# EAGLE design March (EAGLE 9.0.1)
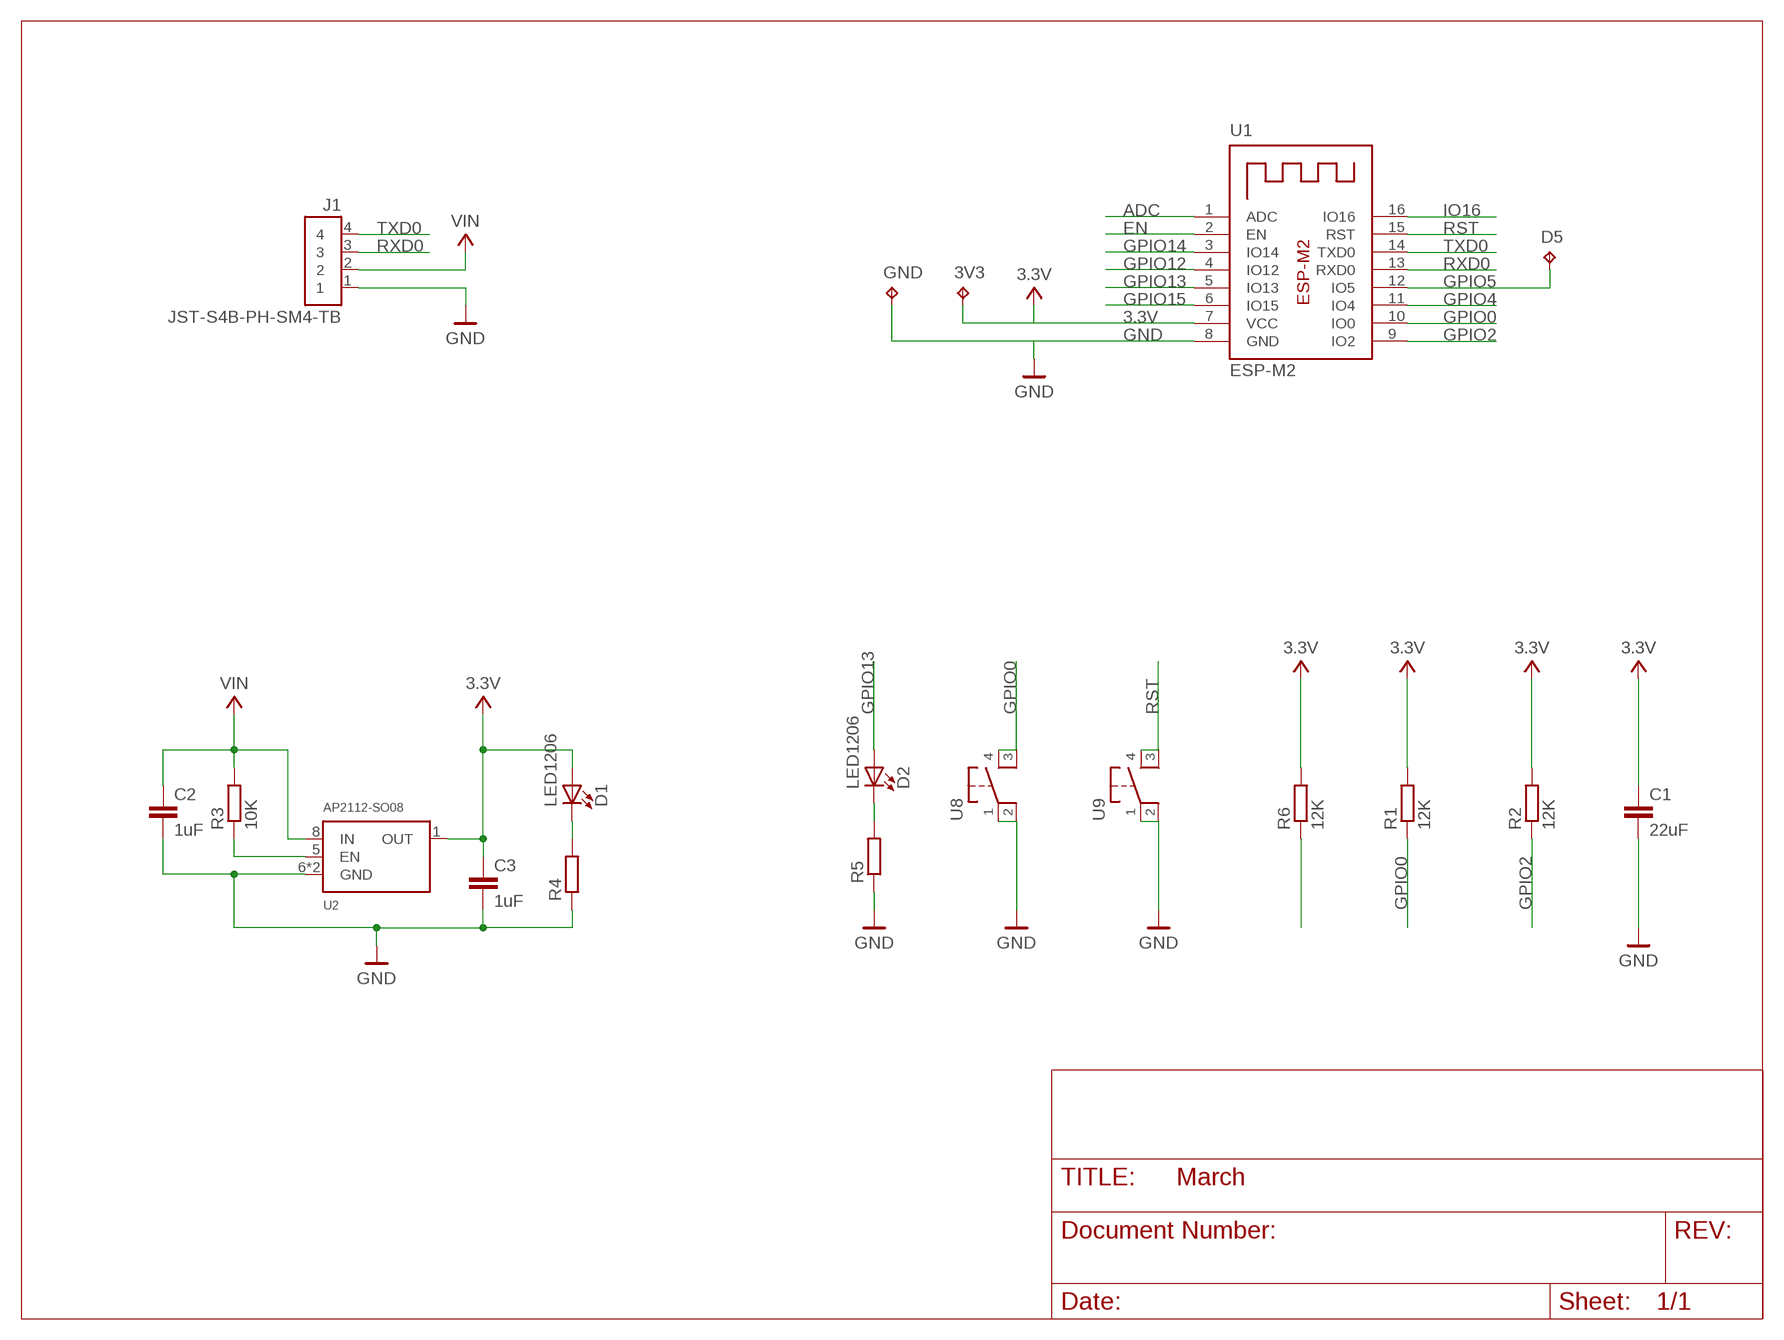
[diagram p0: schematic, sheet 1]

## Parts
3V3  TPTP16R  [TP16R]
C1  22uF  C-EUC1206  [C1206]
C2  1uF  C-EUC1206  [C1206]
C3  1uF  C-EUC1206  [C1206]
D1  LED1206  [LED1206]
D2  LED1206  [LED1206]
D5  TPTP16R  [TP16R]
GND  TPTP16R  [TP16R]
J1  JST-S4B-PH-SM4-TB  [JST-S4B-PH-SM4-TB]
R1  12K  R-EU_R1206  [R1206]
R2  12K  R-EU_R1206  [R1206]
R3  10K  R-EU_R1206  [R1206]
R4  R-EU_R1206  [R1206]
R5  R-EU_R1206  [R1206]
R6  12K  R-EU_R1206  [R1206]
U1  ESP-M2  [ESP-M2]
U2  AP2112-SO08  [SO08]
U8  PTS647  [PTS647]
U9  PTS647  [PTS647]

## Nets
3.3V: 3V3.TP C1.1 C3.1 D1.2(A) R1.2 R2.2 R6.2 U1.7(VCC) U2.1(OUT)
ADC: U1.1(ADC)
EN: R6.1 U1.2(EN)
GND: C1.2 C2.2 C3.2 GND.TP J1.1 R4.1 R5.1 U1.8(GND) U2.6(GND) U2.7(GND) U8.1 U8.2 U9.1 U9.2
GPIO0: R1.1 U1.10(IO0) U8.3 U8.4
GPIO2: R2.1 U1.9(IO2)
GPIO4: U1.11(IO4)
GPIO5: D5.TP U1.12(IO5)
GPIO12: U1.4(IO12)
GPIO13: D2.2(A) U1.5(IO13)
GPIO14: U1.3(IO14)
GPIO15: U1.6(IO15)
IO16: U1.16(IO16)
N$1: D1.1(C) R4.2
N$2: R3.1 U2.5(EN)
N$4: D2.1(C) R5.2
RST: U1.15(RST) U9.3 U9.4
RXD0: J1.3 U1.13(RXD0)
TXD0: J1.4 U1.14(TXD0)
VIN: C2.1 J1.2 R3.2 U2.8(IN)

## Library data of the parts
3V3 D5 GND = testpad:TP: Test pad
C1-C3 = rcl:C-EU: CAPACITOR, European symbol; SPICEPREFIX: C
D1 D2 = Ooo-LED:LED1206
J1 = Ooo-Connectors:JST-S4B-PH-SM4-TB
R1-R3 R6 = rcl:R-EU_: RESISTOR, European symbol; SPICEPREFIX: R
R4 R5 = resistor:R-EU_: RESISTOR, European symbol
U1 = Ooo-IC-Microcontroller:ESP-M2
U2 = Ooo-IC-Power:AP2112-SO08
U8 U9 = Ooo-Switches:PTS647: C&K PTS647 Tact Switch

## Board
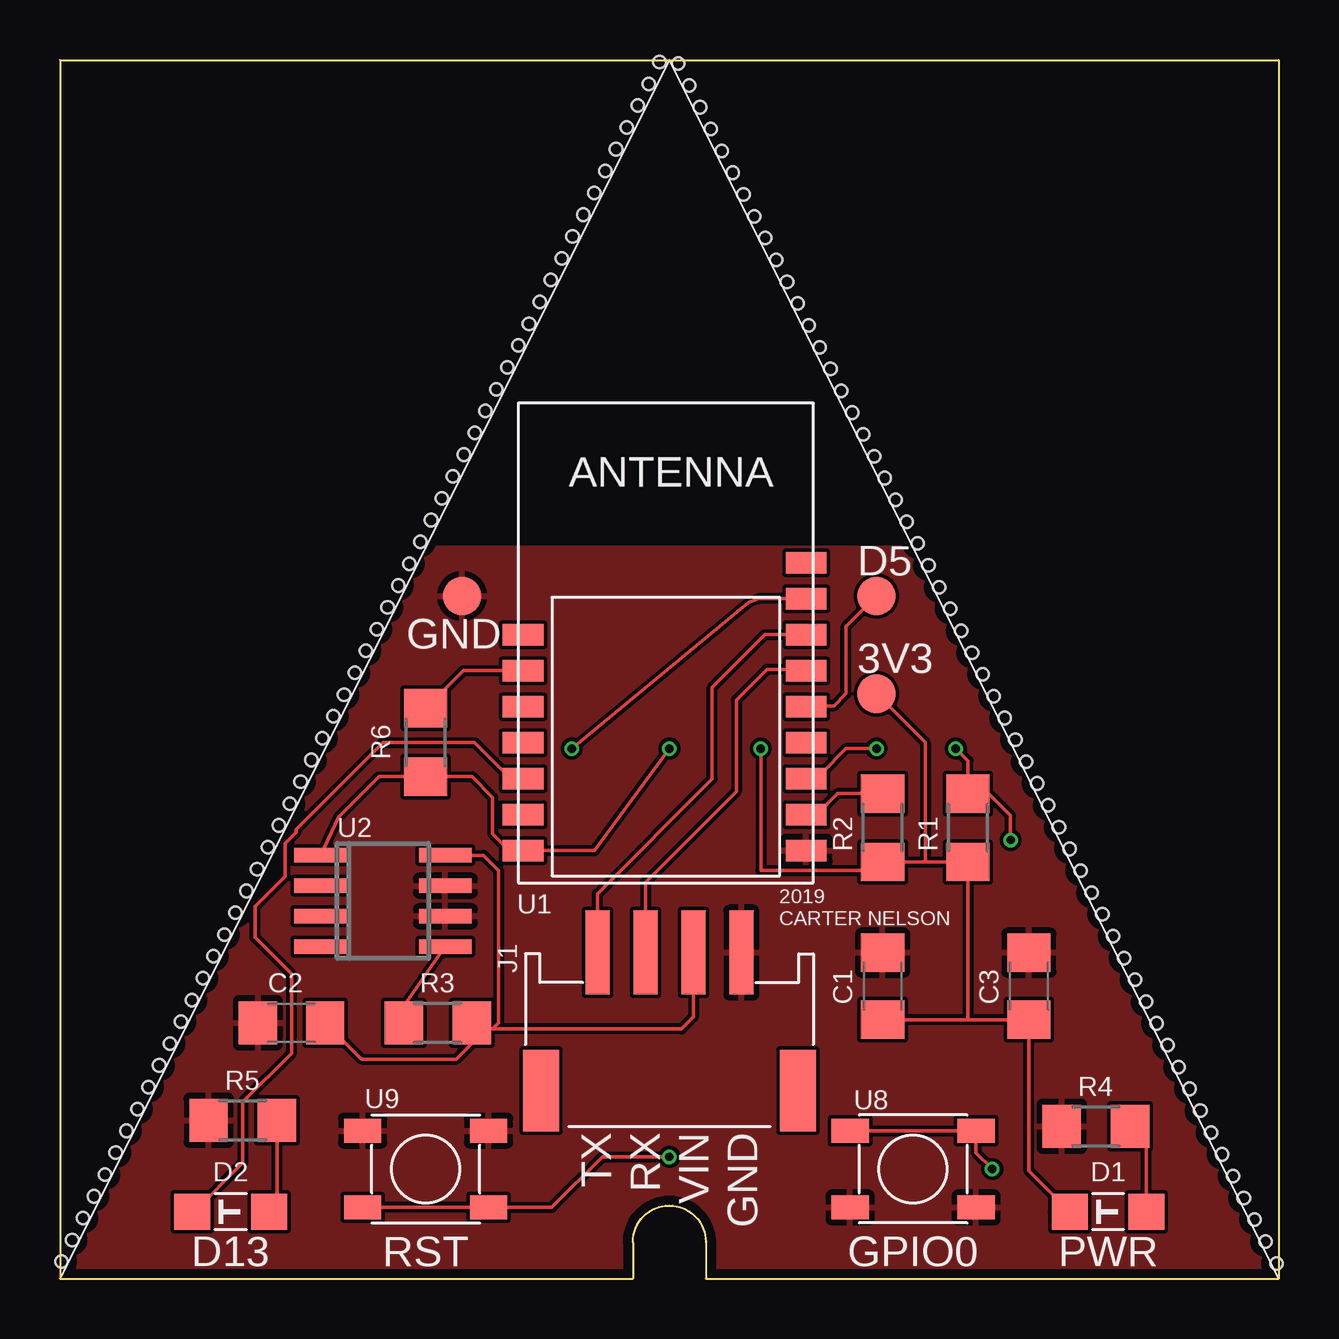
[diagram p1: board, top side]
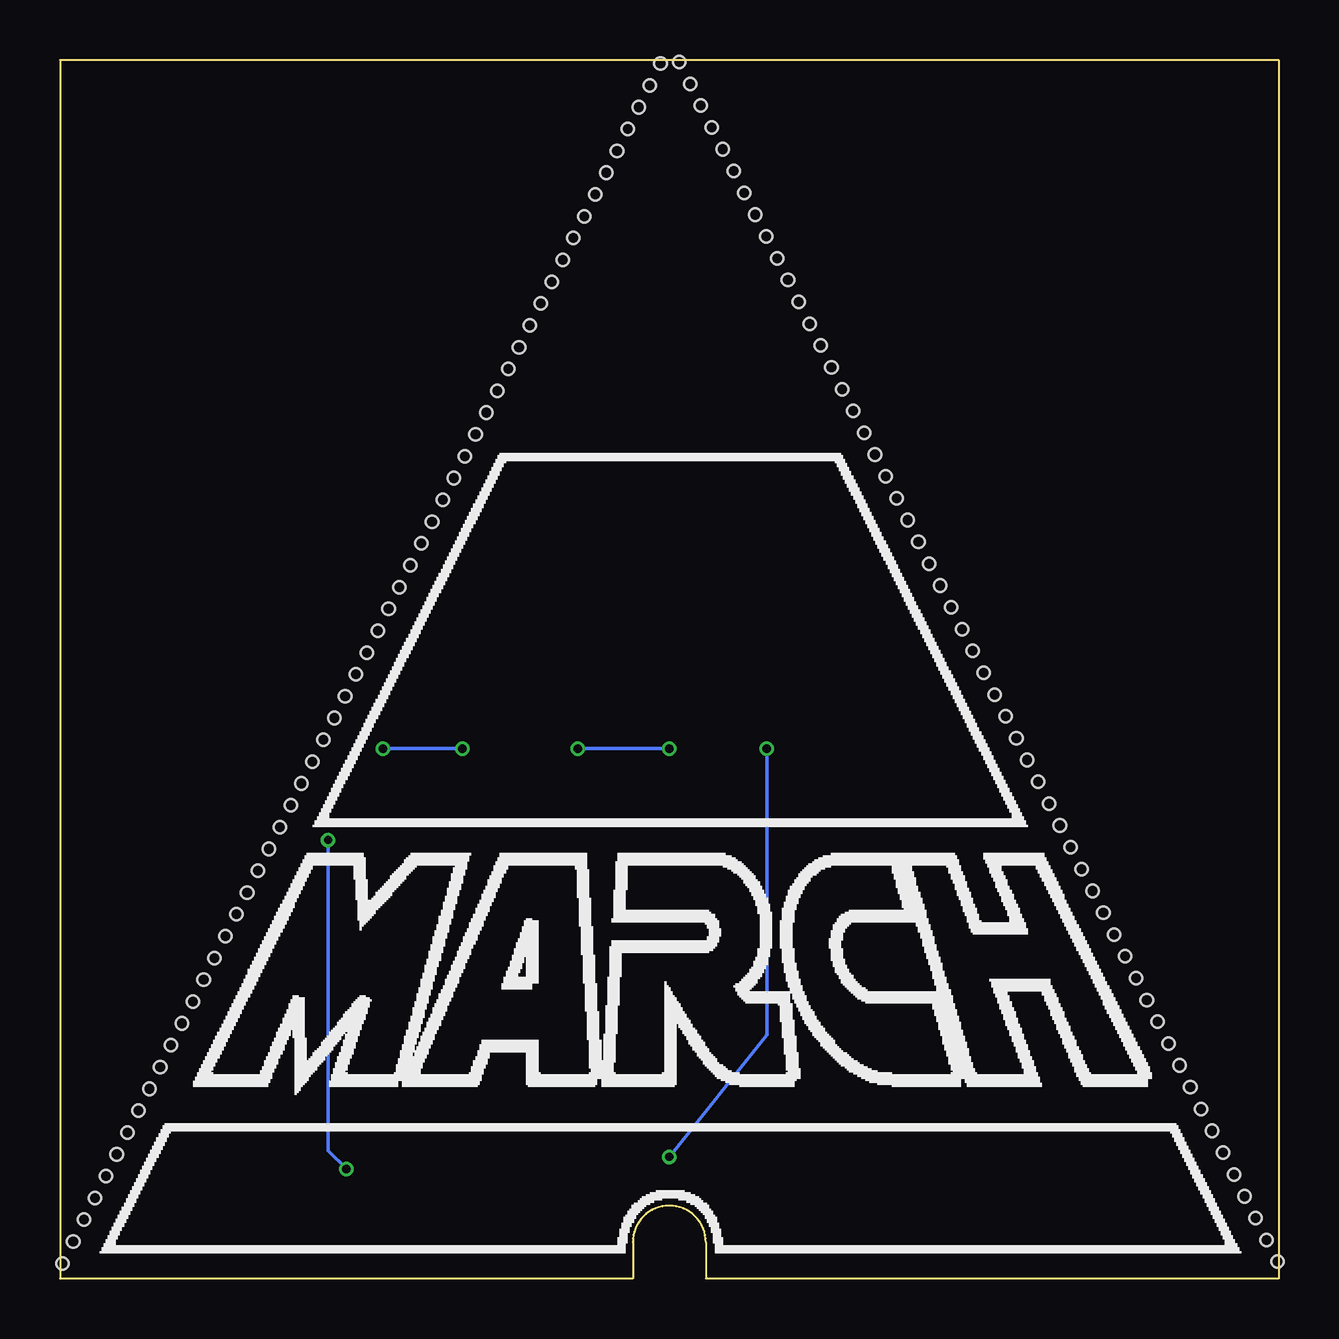
[diagram p2: board, bottom side, seen from below]

Size 50.8 x 50.8 mm. Coordinates in mm from the lower left corner, seen from the top.
Outline: 0,0 23.88,0 23.88,1.52 arc-180 26.92,1.52 26.92,0 50.8,0 50.8,50.8 0,50.8 0,0
Copper layers (1*16): Top 0.035559375mm / dielectric 1.6mm / Bottom 0.035559375mm
Design rules "oshpark-2layer": minimum track width 6mil, minimum drill 10mil, track to track 6mil, track to pad 6mil, pad to pad 6mil, via to via 6mil, smd to smd 6mil, copper to edge 15mil, drill to drill 6mil, minimum pad ring 5mil, minimum via ring 5mil, stop-mask expansion 2.5mil, vias tented up to drill 0mil, thermal gap 10mil
Holes 0.51 mm at 0.06,0.71 0.51,1.62 0.96,2.53 1.42,3.44 1.87,4.35 2.32,5.26 2.78,6.16 3.23,7.07 3.68,7.98 4.14,8.89 4.59,9.8 5.04,10.71 5.5,11.62 5.95,12.53 6.4,13.44 6.86,14.35 7.31,15.26 7.76,16.17 8.22,17.08 8.67,17.98 9.12,18.89 9.58,19.8 10.03,20.71 10.48,21.62 10.94,22.53 11.39,23.44 11.84,24.35 12.3,25.26 12.75,26.17 13.2,27.08 13.66,27.99 14.11,28.9 14.56,29.8 15.02,30.71 15.47,31.62 15.92,32.53 16.38,33.44 16.83,34.35 17.28,35.26 17.74,36.17 18.19,37.08 18.64,37.99 19.1,38.9 19.55,39.81 20,40.72 20.46,41.63 20.91,42.53 21.36,43.44 21.82,44.35 22.27,45.26 22.72,46.17 23.18,47.08 23.63,47.99 24.08,48.9 24.54,49.81 24.99,50.72 50.7,0.64 50.25,1.55 49.8,2.46 49.34,3.37 48.89,4.28 48.44,5.19 47.98,6.1 47.53,7.01 47.08,7.91 46.62,8.82 46.17,9.73 45.72,10.64 45.26,11.55 44.81,12.46 44.36,13.37 43.9,14.28 43.45,15.19 43,16.1 42.54,17.01 42.09,17.92 41.64,18.83 41.18,19.73 40.73,20.64 40.28,21.55 39.82,22.46 39.37,23.37 38.92,24.28 38.46,25.19 38.01,26.1 37.56,27.01 37.1,27.92 36.65,28.83 36.2,29.74 35.74,30.65 35.29,31.55 34.84,32.46 34.38,33.37 33.93,34.28 33.48,35.19 33.02,36.1 32.57,37.01 32.12,37.92 31.66,38.83 31.21,39.74 30.76,40.65 30.3,41.56 29.85,42.47 29.4,43.38 28.94,44.28 28.49,45.19 28.04,46.1 27.58,47.01 27.13,47.92 26.68,48.83 26.22,49.74 25.77,50.65

### Footprints (pad centres in the part's own frame; a part is rotated, then mirrored left to right if it is on the bottom)
TP16R = smd 1.6 x 1.6: TP 0,0
C1206 = smd 1.6 x 1.8: 1 -1.4,0; 2 1.4,0
LED1206 = smd 1.5 x 1.5: 1 -1.6,0; 2 1.6,0
JST-S4B-PH-SM4-TB = smd 3.5 x 1: 1 -7.25,3; 2 -7.25,1; 3 -7.25,-1; 4 -7.25,-3 | smd 3.4 x 1.5: 5 -1.5,5.35; 6 -1.5,-5.35
R1206 = smd 1.6 x 1.803: 1 -1.422,0; 2 1.422,0
ESP-M2 = smd 1.7 x 0.9: 1 -6.1,1.45; 2 -6.1,-0.05; 3 -6.1,-1.55; 4 -6.1,-3.05; 5 -6.1,-4.55; 6 -6.1,-6.05; 7 -6.1,-7.55; 8 5.7,-7.55; 9 5.7,-6.05; 10 5.7,-4.55; 11 5.7,-3.05; 12 5.7,-1.55; 13 5.7,-0.05; 14 5.7,1.45; 15 5.7,2.95; 16 5.7,4.45
SO08 = smd 0.6 x 2.2: 1 -1.905,-2.6; 2 -0.635,-2.6; 3 0.635,-2.6; 4 1.905,-2.6; 5 1.905,2.6; 6 0.635,2.6; 7 -0.635,2.6; 8 -1.905,2.6
PTS647 = smd 1.55 x 1: 1 -2.625,1.6; 2 2.625,1.6; 3 -2.625,-1.6; 4 2.625,-1.6

### Placement (x,y rotation side)
3V3  34.04,24.38 0 top
C1  34.29,12.19 90 top
C2  9.65,10.67 180 top
C3  40.39,12.19 90 top
D1  43.69,2.79 180 top
D2  7.11,2.79 180 top
D5  34.04,28.45 0 top
GND  16.76,28.45 0 top
J1  25.4,6.35 270 top
R1  37.85,18.8 270 top
R2  34.29,18.8 270 top
R3  15.75,10.67 0 top
R4  43.18,6.35 0 top
R5  7.62,6.6 0 top
R6  15.24,22.35 270 top
U1  25.4,25.4 0 top
U2  13.46,15.75 270 top
U8  35.56,4.57 180 top
U9  15.24,4.57 0 top

### Tracks (layer width: path | path; a pad name or v marks a point on that pad's centre or on a via)
3.3V  (via drill 0.35)
  Top 0.152: D1.2 41.4,2.79 | 40.39,10.67 40.13,10.41 | 40.39,10.67 40.39,4.5 D1.2 | 37.85,10.79 C3.1 40.39,10.67 | 37.85,10.79 34.92,10.79 34.8,10.67 34.41,10.67 C1.1 | 36.07,17.37 R2.2 33.93,17.02 29.21,17.02 v29.21,22.1 | 36.07,17.37 R1.2 37.85,10.79 | U2.1 11.62,19.24 13.31,20.93 R6.2 17.17,20.93 18.03,20.07 18.03,18.54 18.73,17.85 U1.7 22.28,17.85 v25.4,22.1 | 3V3.TP 36.07,22.35 36.07,17.37 | D1.2 42.16,2.79
  Bottom 0.152: v25.4,22.1 v29.21,22.1
EN
  Top 0.152: R6.1 16.82,25.35 U1.2
GND
  pour Top: 0,0 15.24,30.48 35.56,30.48 50.8,0
GPIO0  (via drill 0.35)
  Top 0.152: v37.34,22.1 37.85,21.59 R1.1 38.51,20.22 38.61,20.32 39.62,19.3 v39.62,18.29 | v34.04,22.1 32.77,22.1 31.75,21.08 31.75,20.83 31.12,20.83 U1.10 | U8.4 U8.3 38.19,5.25 v38.86,4.57
  Bottom 0.152: v37.34,22.1 v34.04,22.1 | v38.86,4.57 39.62,5.33 v39.62,18.29
GPIO2
  Top 0.152: R2.1 32.41,20.22 31.54,19.35 U1.9
GPIO5
  Top 0.152: U1.12 31.13,23.88 32.26,23.88 32.77,24.38 32.77,27.18 D5.TP
GPIO13
  Top 0.152: U1.5 18.77,20.85 17.27,22.35 13.46,22.35 9.84,18.73 9.84,18.6 9.38,18.15 9.38,16.78 8.13,15.52 8.13,14.22 9.65,12.7 9.65,9.4 7.62,7.37 7.62,4.83 5.59,2.79 D2.2
N$1
  Top 0.152: 44.83,6.22 44.7,6.35 | 45.29,6.22 44.96,6.22 | 44.96,6.22 44.83,6.22 | D1.1 45.29,5.89 44.96,6.22 | R4.2 44.73,6.22 44.83,6.22
N$2
  Top 0.152: U2.5 14.33,11.35 R3.1
N$4
  Top 0.152: D2.1 9.04,3.12 R5.2
RST  (via drill 0.35)
  Top 0.152: U1.15 29.11,28.35 28.7,28.19 v21.34,22.1 | U9.3 U9.4 20.5,2.97 22.61,5.08 v25.4,5.08
  Bottom 0.152: v21.34,22.1 21.34,10.16 v25.4,5.08
RXD0
  Top 0.152: U1.13 31.05,25.4 29.46,25.4 28.19,24.13 28.19,20.32 24.4,16.53 J1.3
TXD0
  Top 0.152: J1.4 22.4,16.05 27.18,20.83 27.18,24.64 29.39,26.85 U1.14
VIN
  Top 0.152: J1.2 26.4,10.91 25.91,10.41 18.03,10.41 | 18.03,10.41 17.53,10.41 | 17.53,10.41 17.42,10.41 R3.2 | U2.8 17.65,17.65 18.29,17.02 18.29,10.67 18.03,10.41 | C2.1 12.58,9.14 16.51,9.14 17.53,10.16 17.53,10.41

### Text on the board
tPlace: 2019 / CARTER NELSON | TX | RX | VIN | GND | D13 | RST | GPIO0 | PWR